# Altium schematic sheet dcb_single_input.SchDoc
size A4; SheetNumber: 7; SheetTotal: 8
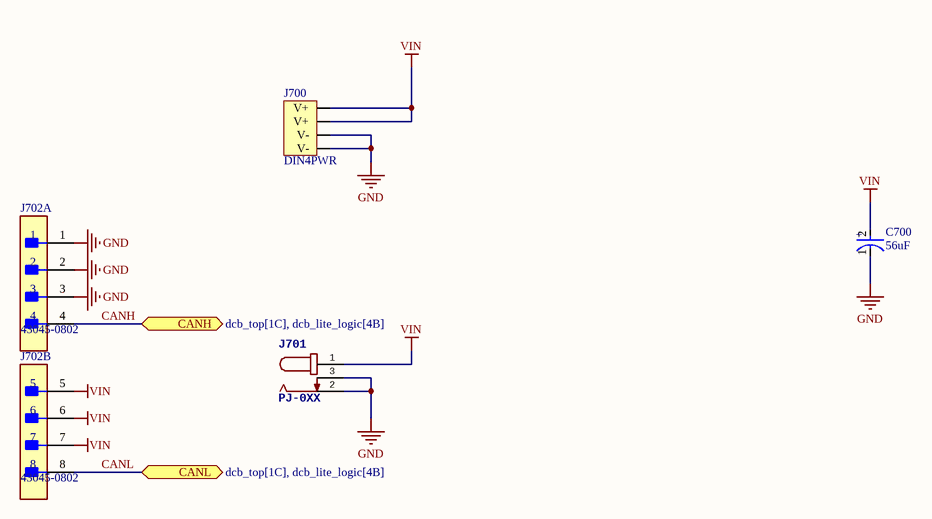
[diagram p0: dcb_single_input.SchDoc]

## Parts
C700  value 56uF  [FP-FKG-MFG]  (hidden comment: CAP 56uF 63V Poly 10mm)
J700  DIN4PWR  [PD40S]
J701  PJ-0XX  [CUI-PJ-002A_V]
J702  43045-0802  [FP-43045-0802-MFG]  (parts A,B of 2)

## Ports
CANH (bidir, see dcb_top[1C], dcb_lite_logic[4B]), CANL (bidir, see dcb_top[1C], dcb_lite_logic[4B])

## Nets
GND: C700.1(C) J700.1(V-) J700.3(V-) J701.2 J701.3 J702.1 J702.2 J702.3
VIN: C700.2(A) J700.2(V+) J700.4(V+) J701.1 J702.5 J702.6 J702.7
CANH: J702.4 ; port CANH
CANL: J702.8 ; port CANL

## Notes on the sheet
- Title
- Size:
- Date:
- A4
- Number:
- Time:
- Revision:
- Sheet
- of
- github.com/blueacro
- blueacro.com
- CERN OHL v2.0
- Made available under the
- File:
- © 2024 StackFoundry LLC. All Rights Reserved.
- (in symbol CMP-001-00124-1) +

## Library data of the parts
C700 = CMP-001-00124-1: Cap Aluminum 56uF 63V 20% (10 X 10.2mm) SMD 0.03 Ohm 1800mA 5000h 105 C Embossed T/R; Lead Diameter: 0.9mm; Ripple Current: 1.8A; ESR (Equivalent Series Resistance): 30mR; Material: Polymer; Leakage Current: 3uA; Life (Hours): 5000Hour; Tolerance: 20%; Diameter: 10mm; Min Operating Temperature: -55°C; Package Quantity: 500; Max Operating Temperature: 105°C; Voltage Rating (DC): 63V; Lead Pitch: 4.6mm; Ratings: AEC-Q200; Termination: SMD/SMT; Length: 10.2mm; Voltage Rating: 63V; RoHS Compliant: Yes; Ripple Current (AC): 1.8A; Series: ZA; Mounting Technology: Surface Mount,PCB; Height: 10.2mm; Radiation Hardening: No; Case/Package: Radial; Technology: HYBRID; Reach SVHC Compliant: No; Voltage: 63V; Packaging: Tape and Reel; Construction: Cylindrical; Lead Free: Lead Free
J700 = CMP-167-0005-1: Design Item ID: DIN4PWR; Source: con-jack.SCHLIB
J701 = CMP-167-0003-2: 2.0 x 6.5 mm, 2.5 A, Horizontal, Through Hole, Dc Power Jack Connector; Design Item ID: PJ-0XX; Source: con-jack.SCHLIB
J702 = CMP-002-00102-1: Conn, Rect/PCB, Header, Rt Angle, 2 Row, 8 Pos, Micro-Fit 3.0, Gold, SMT, GlowWire Comp.; Number of Circuits: 8; Connector Type: Plug; Contact Resistance: 10mR; Max Current Rating: 5A; Glow Wire Compliant: Compliant; Voltage Rating: 250V; Row Spacing: 3mm; Gender: Male; Insulation Resistance: 1GR; RoHS Compliant: Yes; Diameter: 3mm; Lead Free: Lead Free; Height: 8.77mm; Color: Black; Reach SVHC Compliant: Yes; Housing Color: Black; Contact Plating: Gold; Min Operating Temperature: -40°C; Halogen Free: Low Halogen; Mounting Technology: Through Hole; Flammability Rating: UL94 V-0; Package Quantity: 1440; Housing Material: Thermoplastic; Packaging: Tray; Series: Micro-Fit 3.0; Length: 16.15mm; Current Rating: 5A; Termination: Solder; Orientation: Right Angle; Depth: 12.2mm; Number of Rows: 2; Number of Positions: 8; Case/Package: 0802; Contact Material: Brass; Pitch: 3mm; Max Operating Temperature: 105°C; Number of Contacts: 8; Voltage Rating (DC): 250V